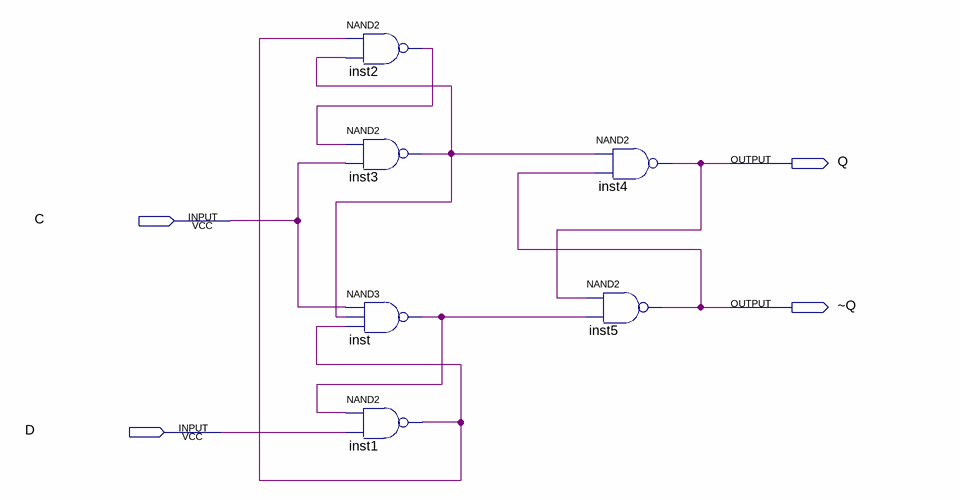
[diagram p0: schematic sheet]
// Quartus schematic hom_4.bdf as structural Verilog: 6 symbols, 4 pins
module hom_4 (
  input  C,
  input  D,
  output Q,
  output \~Q 
);

  wire inst1_out, inst2_out, inst3_out, inst_out;

  nand inst2 (inst2_out, inst1_out, inst3_out);
  nand inst3 (inst3_out, inst2_out, C);
  nand inst (inst_out, C, inst3_out, inst1_out);
  nand inst1 (inst1_out, inst_out, D);
  nand inst5 (\~Q , Q, inst_out);
  nand inst4 (Q, inst3_out, \~Q );
endmodule
